# Altium schematic sheet P03_MPU2_Comm.SchDoc
size A
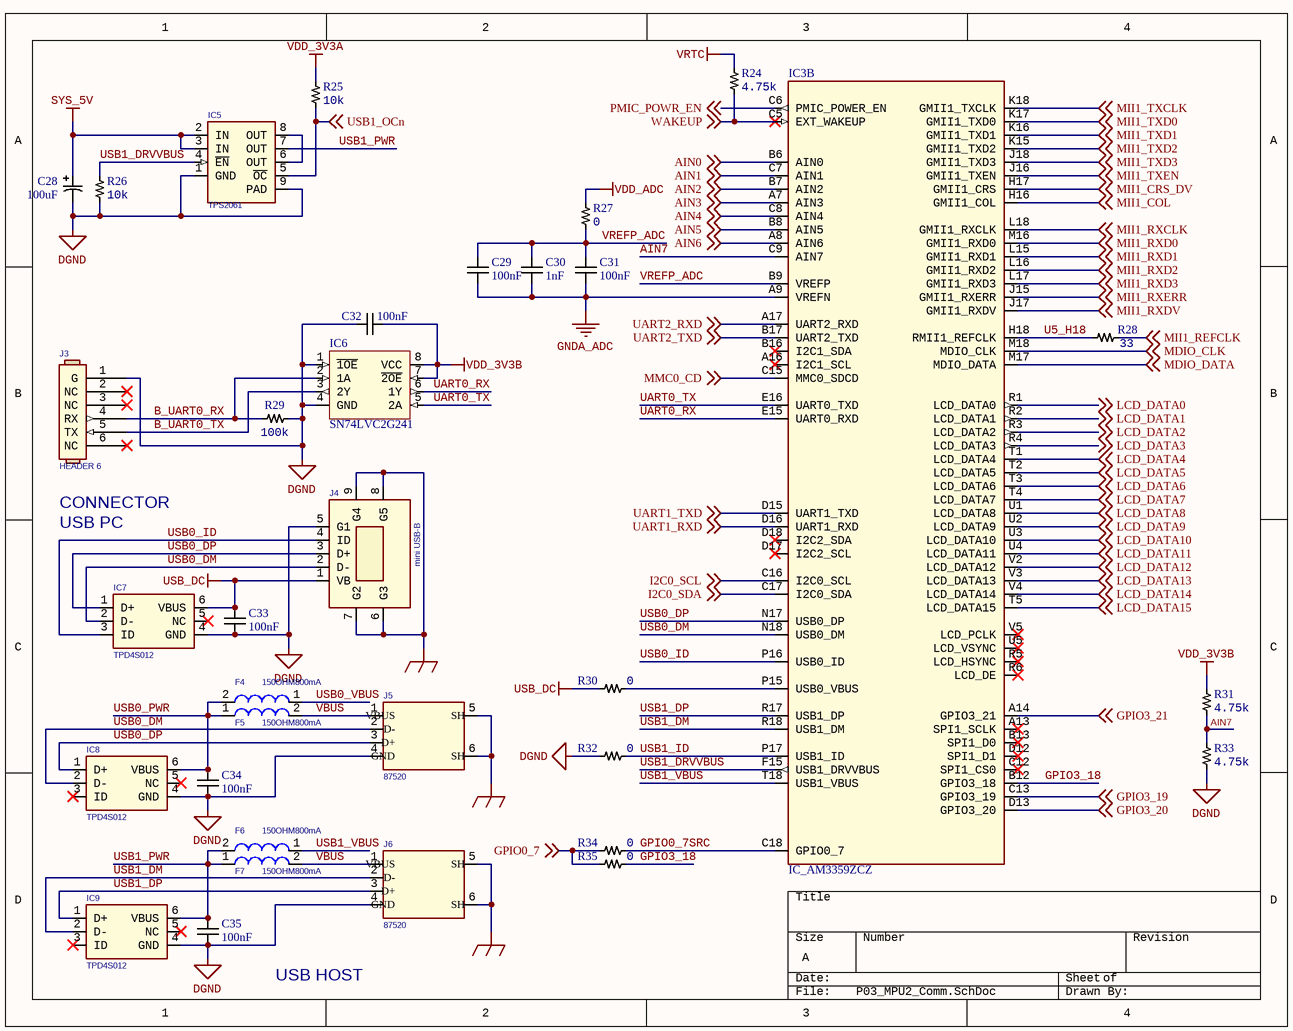
[diagram p0: P03_MPU2_Comm.SchDoc]

## Parts
C28  Capacitance: 100uF  [CAP6.6x6.6]  (hidden comment: EEE-0JA101SP)
C29  Capacitance: 100nF  [CAP0402]  (hidden comment: C0402C104K4RACTU)
C30  Capacitance: 1nF  [CAP0402]  (hidden comment: CC0402KRX7R9BB102)
C31  Capacitance: 100nF  [CAP0402]  (hidden comment: C0402C104K4RACTU)
C32  Capacitance: 100nF  [CAP0402]  (hidden comment: C0402C104K4RACTU)
C33  Capacitance: 100nF  [CAP0402]  (hidden comment: C0402C104K4RACTU)
C34  Capacitance: 100nF  [CAP0402]  (hidden comment: C0402C104K4RACTU)
C35  Capacitance: 100nF  [CAP0402]  (hidden comment: C0402C104K4RACTU)
F4  150OHM800mA  [FB0805]
F5  150OHM800mA  [FB0805]
F6  150OHM800mA  [FB0805]
F7  150OHM800mA  [FB0805]
IC3  IC_AM3359ZCZ  [BGA-324]  (part B of 7)
IC5  TPS2061  [HVSSOP-8]
IC6  SN74LVC2G241  [VSSOP-8]
IC7  TPD4S012  [U_6_DRY]
IC8  TPD4S012  [U_6_DRY]
IC9  TPD4S012  [U_6_DRY]
J3  HEADER 6  [SIP6]
J4  mini USB-B  [USB5MINI_4SHIELDED_SMD-5]
J5  87520  [USB_A]
J6  87520  [USB_A]
R24  Resistance: 4.75k  [RES0402]  (hidden comment: RC0402FR-074K75L)
R25  Resistance: 10k  [RES0402]  (hidden comment: RC0402FR-0710KL)
R26  Resistance: 10k  [RES0402]  (hidden comment: RC0402FR-0710KL)
R27  Resistance: 0  [RES0402]  (hidden comment: RC0402JR-070RL)
R28  Resistance: 33  [RES0402]  (hidden comment: RC0402FR-0733RL)
R29  Resistance: 100k  [RES0402]  (hidden comment: RC0402FR-07100KL)
R30  Resistance: 0  [RES0402]  (hidden comment: RC0402JR-070RL)
R31  Resistance: 4.75k  [RES0402]  (hidden comment: RC0402FR-074K75L)
R32  Resistance: 0  [RES0402]  (hidden comment: RC0402JR-070RL)
R33  Resistance: 4.75k  [RES0402]  (hidden comment: RC0402FR-074K75L)
R34  Resistance: 0  [RES0402]  (hidden comment: RC0402JR-070RL)
R35  Resistance: 0  [RES0402]  (hidden comment: RC0402JR-070RL)

## Nets
DGND: C28.2(C) C32.1 C33.2 C34.2 C35.2 IC5.1(GND) IC5.9(PAD) IC6.1(~{1OE}) IC6.4(GND) IC7.4(GND) IC8.4(GND) IC9.4(GND) J3.1(G) J4.5(G1) J5.4(P4) J6.4(P4) R26.2 R29.1 R32.1 R33.1
GND_EARTH: J4.6(G3) J4.7(G2) J4.8(G5) J4.9(G4) J5.5(SHELD1) J5.6(PAD4) J6.5(SHELD1) J6.6(PAD4)
GNDA_ADC: C29.2 C30.2 C31.2 IC3.A9(VREFN)
SYS_5V: C28.1(A) IC5.2(IN) IC5.3(IN)
USB_DC: C33.1 IC7.6(VBUS) J4.1(VB) R30.1
VDD_3V3A: R25.1
VDD_3V3B: C32.2 IC6.7(~{2OE}) IC6.8(VCC) R31.2
VDD_ADC: R27.2
VRTC: R24.2
AIN0: IC3.B6(AIN0) ; off-sheet AIN0
AIN1: IC3.C7(AIN1) ; off-sheet AIN1
AIN2: IC3.B7(AIN2) ; off-sheet AIN2
AIN3: IC3.A7(AIN3) ; off-sheet AIN3
AIN4: IC3.C8(AIN4) ; off-sheet AIN4
AIN5: IC3.B8(AIN5) ; off-sheet AIN5
AIN6: IC3.A8(AIN6) ; off-sheet AIN6
AIN7: IC3.C9(AIN7) R31.1 R33.2
B_UART0_RX: IC6.2(1A) J3.4(RX) R29.2
B_UART0_TX: IC6.3(2Y) J3.5(TX)
GPIO0_7: R34.2 R35.1 ; off-sheet GPIO0_7
GPIO0_7SRC: IC3.C18(GPIO0_7) R34.1
GPIO3_18: IC3.B12(GPIO3_18) R35.2
GPIO3_19: IC3.C13(GPIO3_19) ; off-sheet GPIO3_19
GPIO3_20: IC3.D13(GPIO3_20) ; off-sheet GPIO3_20
GPIO3_21: IC3.A14(GPIO3_21) ; off-sheet GPIO3_21
I2C0_SCL: IC3.C16(I2C0_SCL) ; off-sheet I2C0_SCL
I2C0_SDA: IC3.C17(I2C0_SDA) ; off-sheet I2C0_SDA
LCD_DATA0: IC3.R1(LCD_DATA0) ; off-sheet LCD_DATA0
LCD_DATA1: IC3.R2(LCD_DATA1) ; off-sheet LCD_DATA1
LCD_DATA2: IC3.R3(LCD_DATA2) ; off-sheet LCD_DATA2
LCD_DATA3: IC3.R4(LCD_DATA3) ; off-sheet LCD_DATA3
LCD_DATA4: IC3.T1(LCD_DATA4) ; off-sheet LCD_DATA4
LCD_DATA5: IC3.T2(LCD_DATA5) ; off-sheet LCD_DATA5
LCD_DATA6: IC3.T3(LCD_DATA6) ; off-sheet LCD_DATA6
LCD_DATA7: IC3.T4(LCD_DATA7) ; off-sheet LCD_DATA7
LCD_DATA8: IC3.U1(LCD_DATA8) ; off-sheet LCD_DATA8
LCD_DATA9: IC3.U2(LCD_DATA9) ; off-sheet LCD_DATA9
LCD_DATA10: IC3.U3(LCD_DATA10) ; off-sheet LCD_DATA10
LCD_DATA11: IC3.U4(LCD_DATA11) ; off-sheet LCD_DATA11
LCD_DATA12: IC3.V2(LCD_DATA12) ; off-sheet LCD_DATA12
LCD_DATA13: IC3.V3(LCD_DATA13) ; off-sheet LCD_DATA13
LCD_DATA14: IC3.V4(LCD_DATA14) ; off-sheet LCD_DATA14
LCD_DATA15: IC3.T5(LCD_DATA15) ; off-sheet LCD_DATA15
MDIO_CLK: IC3.M18(MDIO_CLK) ; off-sheet MDIO_CLK
MDIO_DATA: IC3.M17(MDIO_DATA) ; off-sheet MDIO_DATA
MII1_COL: IC3.H16(GMII1_COL) ; off-sheet MII1_COL
MII1_CRS_DV: IC3.H17(GMII1_CRS) ; off-sheet MII1_CRS_DV
MII1_REFCLK: R28.2 ; off-sheet MII1_REFCLK
MII1_RXCLK: IC3.L18(GMII1_RXCLK) ; off-sheet MII1_RXCLK
MII1_RXD0: IC3.M16(GMII1_RXD0) ; off-sheet MII1_RXD0
MII1_RXD1: IC3.L15(GMII1_RXD1) ; off-sheet MII1_RXD1
MII1_RXD2: IC3.L16(GMII1_RXD2) ; off-sheet MII1_RXD2
MII1_RXD3: IC3.L17(GMII1_RXD3) ; off-sheet MII1_RXD3
MII1_RXDV: IC3.J17(GMII1_RXDV) ; off-sheet MII1_RXDV
MII1_RXERR: IC3.J15(GMII1_RXERR) ; off-sheet MII1_RXERR
MII1_TXCLK: IC3.K18(GMII1_TXCLK) ; off-sheet MII1_TXCLK
MII1_TXD0: IC3.K17(GMII1_TXD0) ; off-sheet MII1_TXD0
MII1_TXD1: IC3.K16(GMII1_TXD1) ; off-sheet MII1_TXD1
MII1_TXD2: IC3.K15(GMII1_TXD2) ; off-sheet MII1_TXD2
MII1_TXD3: IC3.J18(GMII1_TXD3) ; off-sheet MII1_TXD3
MII1_TXEN: IC3.J16(GMII1_TXEN) ; off-sheet MII1_TXEN
MMC0_CD: IC3.C15(MMC0_SDCD) ; off-sheet MMC0_CD
PMIC_POWR_EN: IC3.C6(PMIC_POWER_EN) ; off-sheet PMIC_POWR_EN
U5_H18: IC3.H18(RMII1_REFCLK) R28.1
UART0_RX: IC3.E15(UART0_RXD) IC6.6(1Y)
UART0_TX: IC3.E16(UART0_TXD) IC6.5(2A)
UART1_RXD: IC3.D16(UART1_RXD) ; off-sheet UART1_RXD
UART1_TXD: IC3.D15(UART1_TXD) ; off-sheet UART1_TXD
UART2_RXD: IC3.A17(UART2_RXD) ; off-sheet UART2_RXD
UART2_TXD: IC3.B17(UART2_TXD) ; off-sheet UART2_TXD
USB0_DM: IC3.N18(USB0_DM) IC7.2(D-) IC8.2(D-) J4.2(D-) J5.2(P2)
USB0_DP: IC3.N17(USB0_DP) IC7.1(D+) IC8.1(D+) J4.3(D+) J5.3(P3)
USB0_ID: IC3.P16(USB0_ID) IC7.3(ID) J4.4(ID)
USB0_PWR: C34.1 F4.2 F5.1 IC8.6(VBUS)
USB0_VBUS: F4.1
USB1_DM: IC3.R18(USB1_DM) IC9.2(D-) J6.2(P2)
USB1_DP: IC3.R17(USB1_DP) IC9.1(D+) J6.3(P3)
USB1_DRVVBUS: IC3.F15(USB1_DRVVBUS) IC5.4(~{EN}) R26.1
USB1_ID: IC3.P17(USB1_ID) R32.2
USB1_OCn: IC5.5(~{OC}) R25.2 ; off-sheet USB1_OCn
USB1_PWR: C35.1 F6.2 F7.1 IC5.7(OUT) IC9.6(VBUS)
USB1_VBUS: F6.1 IC3.T18(USB1_VBUS)
VBUS: F5.2 F7.2 J5.1(P1) J6.1(P1)
VREFP_ADC: C29.1 C30.1 C31.1 IC3.B9(VREFP) R27.1
WAKEUP: IC3.C5(EXT_WAKEUP) R24.1 ; off-sheet WAKEUP
NetIC3_P15: IC3.P15(USB0_VBUS) R30.2
NetIC5_6: IC5.6(OUT) IC5.8(OUT)

Not connected (* = marked no-connect by the designer): IC3 A13(SPI1_SCLK)* A16(I2C1_SCL)* B13(SPI1_D0)* B16(I2C1_SDA)* C12(SPI1_CS0)* D12(SPI1_D1)* D17(I2C2_SCL)* D18(I2C2_SDA)* R5(LCD_HSYNC)* R6(LCD_DE)* U5(LCD_VSYNC)* V5(LCD_PCLK)*; IC7 5(NC)*; IC8 3(ID)* 5(NC)*; IC9 3(ID)* 5(NC)*; J3 2(NC)* 3(NC)* 6(NC)*

## Notes on the sheet
- (near J3) CONNECTOR
- USB PC
- USB HOST
- Title
- Size:
- Date:
- A
- Number:
- Time:
- Revision:
- Sheet
- of
- File:
- (in symbol CONN_USBA) VBUS; SH; D-; D+; GND

## Library data of the parts
C28 = CAP_POL_100uF: POL CAP 100uF SMD; Manufacturer: Panasonic; Dielectric Material: Aluminium; Ripple Current: 71mA; Tolerance: 20%; Voltage Rating: 6.3V; Life (Hours): 2000Hour; Leakage Current: 3uA; Lead Length: 2.6mm; Supplier 1: Digi-Key; Manufacturer Part Number: EEE-0JA101SP; Stock 1: 67789; Pricing 1: 1=0.35000, 10=0.24000, 100=0.14420, 500=0.10816 (USD); RoHS: Yes; Mount: Surface Mount,PCB; Case/Package: Radial; Number of Pins: 2; Contact Plating: Tin; Min Operating Temperature: -40°C; Max Operating Temperature: 85°C; Ripple Current (AC): 71mA; Packaging: Tape and Reel; Voltage Rating (DC): 6.3V; Package Quantity: 1; Termination: SMD/SMT; Voltage: 6.3V; Features: General Purpose; Diameter: 6.3mm; Length: 5.5mm; Height: 5.4mm; Height - Seated (Max): 0.213inch; Width: 6.6mm; Lead Pitch: 2.2mm; Radiation Hardening: No; REACH SVHC: No SVHC; Lead Free: Lead Free; ComponentLink1URL: https://datasheet.ciiva.com/11779/0900766b8078636e-11779744.pdf?src-supplier=RSComponents; ComponentLink1Description: https://datasheet.ciiva.com/11779/0900766b8078636e-11779744.pdf?src-supplier=RSComponents; ComponentLink2URL: https://datasheet.ciiva.com/14610/70255710-14610022.pdf?src-supplier=Allied+Electronics; ComponentLink2Description: https://datasheet.ciiva.com/14610/70255710-14610022.pdf?src-supplier=Allied+Electronics; ComponentLink3URL: https://datasheet.ciiva.com/30226/11aba0000ce2-30226184.pdf?src-supplier=Onlinecomponents.com; ComponentLink3Description: https://datasheet.ciiva.com/30226/11aba0000ce2-30226184.pdf?src-supplier=Onlinecomponents.com; ComponentLink4URL: https://datasheet.ciiva.com/16397/aba0000ce2-16397066.pdf?src-supplier=Future+Electronics; ComponentLink4Description: https://datasheet.ciiva.com/16397/aba0000ce2-16397066.pdf?src-supplier=Future+Electronics; ComponentLink5URL: https://datasheet.ciiva.com/46387/aba0000ce2-46387964.pdf?src-supplier=Element14; ComponentLink5Description: https://datasheet.ciiva.com/46387/aba0000ce2-46387964.pdf?src-supplier=Element14; ComponentLink6URL: https://datasheet.ciiva.com/14595/70255710-14595757.pdf?src-supplier=Allied+Electronics; ComponentLink6Description: https://datasheet.ciiva.com/14595/70255710-14595757.pdf?src-supplier=Allied+Electronics; ComponentLink7URL: https://datasheet.ciiva.com/2983/aba0000ce2-2983902.pdf?src-supplier=Avnet; ComponentLink7Description: https://datasheet.ciiva.com/2983/aba0000ce2-2983902.pdf?src-supplier=Avnet; ComponentLink8URL: https://datasheet.ciiva.com/43485/aba0000ce2-43485605.pdf?src-supplier=Farnell; ComponentLink8Description: https://datasheet.ciiva.com/43485/aba0000ce2-43485605.pdf?src-supplier=Farnell; ComponentLink9URL: https://datasheet.ciiva.com/24070/aba0000ce2-40801-24070230.pdf?src-supplier=Mouser; ComponentLink9Description: https://datasheet.ciiva.com/24070/aba0000ce2-40801-24070230.pdf?src-supplier=Mouser; ComponentLink10URL: https://datasheet.ciiva.com/46376/aba0000ce2-46376375.pdf?src-supplier=Element14; ComponentLink10Description: https://datasheet.ciiva.com/46376/aba0000ce2-46376375.pdf?src-supplier=Element14; ComponentLink11URL: https://datasheet.ciiva.com/6134/aba0000ce2-6134361.pdf?src-supplier=Farnell; ComponentLink11Description: https://datasheet.ciiva.com/6134/aba0000ce2-6134361.pdf?src-supplier=Farnell; ComponentLink12URL: https://datasheet.ciiva.com/16539/aba0000ce2-16539929.pdf?src-supplier=Avnet+Asia; ComponentLink12Description: https://datasheet.ciiva.com/16539/aba0000ce2-16539929.pdf?src-supplier=Avnet+Asia; ComponentLink13URL: https://datasheet.ciiva.com/15165/getdatasheetpartid-73778-15165850.pdf?src-supplier=Verical; ComponentLink13Description: https://datasheet.ciiva.com/15165/getdatasheetpartid-73778-15165850.pdf?src-supplier=Verical; ComponentLink14URL: https://datasheet.ciiva.com/17353/aba0000ce2-17353295.pdf?src-supplier=Avnet+Europe; ComponentLink14Description: https://datasheet.ciiva.com/17353/aba0000ce2-17353295.pdf?src-supplier=Avnet+Europe; Supplier Part Number 1: PCE3852CT-ND
C29 C31-C35 = CAP_100nF: MLCC 100nF 0402 SMD; Manufacturer: KEMET; Tolerance: 10%; Voltage Rating (DC): 16V; Dielectric: X7R; Dissipation Factor: 3.5%; Supplier 1: Digi-Key; Supplier Part Number 1: 399-3521-1-ND; Manufacturer Part Number: C0402C104K4RACTU; RoHS: Yes; Stock 1: 6512243; Pricing 1: 1=0.10000, 10=0.04200, 100=0.01860, 500=0.01328, 1000=0.01044, 2500=0.00949, 5000=0.00873 (USD); Packaging: Tape and Reel; Mount: Surface Mount; Case/Package: 0402; Case Code (Imperial): 0402; Case Code (Metric): 1005; Contact Plating: Tin,Matte; Min Operating Temperature: -55°C; Max Operating Temperature: 125°C; Package Quantity: 10000; Voltage Rating: 16V; Termination: SMD/SMT; Length: 1mm; Height: 0.5mm; Width: 0.5mm; Depth: 0.5mm; Radiation Hardening: No; ComponentLink2URL: https://datasheet.ciiva.com/18192/getdatasheetpartid-385384-18192412.pdf?src-supplier=Verical; ComponentLink2Description: Datasheet
C30 = CAP_1nF: MLCC 1nF 0402 SMD; Manufacturer: Yageo; Tolerance: 10%; Dielectric Material: Ceramic; Voltage Rating: 50V; Insulation Resistance: 100GR; Supplier 1: Digi-Key; Manufacturer Part Number: CC0402KRX7R9BB102; RoHS: Yes; Stock 1: 3539064; Pricing 1: 1=0.10000, 10=0.02100, 100=0.00920, 500=0.00654, 1000=0.00514, 2500=0.00468, 5000=0.00430 (USD); Packaging: Tape and Reel; ComponentLink1URL: https://datasheet.ciiva.com/11786/0900766b8079c870-11786157.pdf?src-supplier=RSComponents; ComponentLink1Description: https://datasheet.ciiva.com/11786/0900766b8079c870-11786157.pdf?src-supplier=RSComponents; Mount: Surface Mount; Case/Package: 0402; Case Code (Metric): 1005; Case Code (Imperial): 0402; Min Operating Temperature: -55°C; Max Operating Temperature: 125°C; Length: 0.039inch; Width: 0.02inch; Thickness: 0.022inch; Lead Free: Lead Free; Halogen Free: Halogen Free; ComponentLink2URL: https://datasheet.ciiva.com/143/mlccorderingcode-143956.pdf?src-supplier=Digi-Key; ComponentLink2Description: https://datasheet.ciiva.com/143/mlccorderingcode-143956.pdf?src-supplier=Digi-Key; ComponentLink3URL: https://datasheet.ciiva.com/143/mlccorderingcode-143957.pdf?src-supplier=Digi-Key; ComponentLink3Description: https://datasheet.ciiva.com/143/mlccorderingcode-143957.pdf?src-supplier=Digi-Key; ComponentLink4URL: https://datasheet.ciiva.com/143/mlccorderingcode-143958.pdf?src-supplier=Digi-Key; ComponentLink4Description: https://datasheet.ciiva.com/143/mlccorderingcode-143958.pdf?src-supplier=Digi-Key; ComponentLink5URL: https://datasheet.ciiva.com/13389/upy-gp-np0-16v-to-50v-8-13389974.pdf?src-supplier=Mouser; ComponentLink5Description: https://datasheet.ciiva.com/13389/upy-gp-np0-16v-to-50v-8-13389974.pdf?src-supplier=Mouser; ComponentLink6URL: https://datasheet.ciiva.com/16625/upy-gphc-x7r-6-3v-to-50v-8-16625512.pdf?src-supplier=Avnet+Europe; ComponentLink6Description: https://datasheet.ciiva.com/16625/upy-gphc-x7r-6-3v-to-50v-8-16625512.pdf?src-supplier=Avnet+Europe; ComponentLink7URL: https://datasheet.ciiva.com/15189/getdatasheetpartid-403474-15189131.pdf?src-supplier=Verical; ComponentLink7Description: https://datasheet.ciiva.com/15189/getdatasheetpartid-403474-15189131.pdf?src-supplier=Verical; ComponentLink8URL: https://datasheet.ciiva.com/7978/1489800-7978092.pdf?src-supplier=Element14; ComponentLink8Description: https://datasheet.ciiva.com/7978/1489800-7978092.pdf?src-supplier=Element14; ComponentLink9URL: https://datasheet.ciiva.com/22749/1489800-22749213.pdf?src-supplier=Element14; ComponentLink9Description: https://datasheet.ciiva.com/22749/1489800-22749213.pdf?src-supplier=Element14
F4 F6 = FERR: FERRITE 800MA 150 OHM 0805 SMD; Manufacturer: Laird-Signal Integrity Products; Manufacturer Part Number: LI0805H151R-10; PartName: FerriteBead150ohm800mA; Mfr: Steward; TIIntPartnumber: 1L0010; Vendor: Digikey; Impedance @ Frequency: 150 Ohm @ 100MHz; DC Resistance (DCR): 150 mOhm Max; Filter Type: Differential Mode - Single; Supplier 1: Digi-Key; Supplier Part Number 1: 240-2384-6-ND; RoHS: RoHS Compliant; Category: Filters; Stock 1: 3694; Pricing 1: 1=0.1, 10=0.07, 25=0.064, 50=0.0574, 100=0.0421, 250=0.03064, 500=0.02808, 1000=0.02424 (USD); Package / Case: 0805 (2012 Metric); Size / Dimension: 0.079" L x 0.049" W (2.00mm x 1.25mm); Packaging: Digi-Reel®; ComponentLink1URL: http://www.lairdtech.com/WorkArea/linkit.aspx?LinkIdentifier=id&ItemID=4912; ComponentLink1Description: http://www.lairdtech.com/WorkArea/linkit.aspx?LinkIdentifier=id&ItemID=4912; MfrNum: LI0805H151R-10; Current Rating: 800mA; Mounting Type: Surface Mount; Height (Max): 0.043" (1.10mm)
F5 F7 = FERR: FERRITE 800MA 150 OHM 0805 SMD; PartName: FerriteBead150ohm800mA; Mfr: Steward; MfrNum: LI0805H151R-10; TIIntPartnumber: 1L0010; Manufacturer: Laird-Signal Integrity Products; Vendor: Digikey; Impedance @ Frequency: 150 Ohm @ 100MHz; DC Resistance (DCR): 150 mOhm Max; Filter Type: Differential Mode - Single; Supplier 1: Digi-Key; Supplier Part Number 1: 240-2384-6-ND; Manufacturer Part Number: LI0805H151R-10; RoHS: RoHS Compliant; Category: Filters; Stock 1: 3694; Pricing 1: 1=0.1, 10=0.07, 25=0.064, 50=0.0574, 100=0.0421, 250=0.03064, 500=0.02808, 1000=0.02424 (USD); Current Rating: 800mA; Package / Case: 0805 (2012 Metric); Mounting Type: Surface Mount; Packaging: Digi-Reel®; Height (Max): 0.043" (1.10mm); Size / Dimension: 0.079" L x 0.049" W (2.00mm x 1.25mm); ComponentLink1URL: http://www.lairdtech.com/WorkArea/linkit.aspx?LinkIdentifier=id&ItemID=4912; ComponentLink1Description: http://www.lairdtech.com/WorkArea/linkit.aspx?LinkIdentifier=id&ItemID=4912
IC3 = IC_AM335X_ZCE_1: SubArctic Cortex A8 Processor 18x18; Manufacturer: Texas Instruments; Manufacturer Part Number: XAM3359ZCZ; Processor Type: ARM Microprocessor; Voltage: 1.06 V ~ 1.15 V; Supplier 1: Digi-Key; Supplier Part Number 1: 296-35073-ND; RoHS: RoHS Compliant; Category: Integrated Circuits (ICs); Stock 1: 16; Pricing 1: 1=33.5, 10=30.988, 100=26.465, 250=24.28752, 500=23.115, 1000=21.775, 2500=21.105, 5000=20.6025, 10000=20.1 (USD); Features: -; Speed: -; Mounting Type: Surface Mount; Package / Case: 324-LFBGA; Supplier Device Package: 324-NFBGA(15x15); Packaging: Tray; ComponentLink1URL: http://www.ti.com/lit/ds/symlink/am3354.pdf; ComponentLink1Description: http://www.ti.com/lit/ds/symlink/am3354.pdf
IC5 = TPS2061: IC 1.5A PWR DIST SWITCH 8-SOIC; Manufacturer: Texas Instruments; Manufacturer Part Number: TPS2051BDGNR; Number of Outputs: 1; Rds (On): 135 mOhm; Internal Switch(s): Yes; Current Limit: 1A; Voltage - Input: 2.7 V ~ 5.5 V; Supplier 1: Digi-Key; Supplier Part Number 1: 296-17313-6-ND; RoHS: RoHS Compliant; Category: Integrated Circuits (ICs); Stock 1: 7065; Pricing 1: 1=1.82, 10=1.642, 25=1.4708, 100=1.3224, 250=1.1742, 500=1.026, 1000=0.8493 (USD); Type: High Side Switch; Operating Temperature: -40°C ~ 85°C; Mounting Type: Surface Mount; Package / Case: 8-TSSOP, 8-MSOP (0.118", 3.00mm Width) Exposed Pad; Supplier Device Package: 8-MSOP-PowerPad; Packaging: Digi-Reel®; ComponentLink1URL: http://www.ti.com/lit/ds/symlink/tps2061.pdf; ComponentLink1Description: Datasheet
IC6 = SN74LVC2G241: IC BUFF/DVR TRI-ST DL 8VSSOP; Manufacturer: Texas Instruments; Manufacturer Part Number: SN74LVC2G241DCUR; Logic Type: Buffer/Line Driver, Non-Inverting; Number of Elements: 2; Number of Bits per Element: 1; Current - Output High, Low: 32mA, 32mA; Voltage - Supply: 1.65 V ~ 5.5 V; Supplier 1: Digi-Key; Supplier Part Number 1: 296-11936-6-ND; RoHS: RoHS Compliant; Category: Integrated Circuits (ICs); Stock 1: 28602; Pricing 1: 1=0.49, 10=0.428, 25=0.3756 (USD); Operating Temperature: -40°C ~ 85°C; Mounting Type: Surface Mount; Package / Case: 8-VFSOP (0.091", 2.30mm Width); Supplier Device Package: US8; Packaging: Digi-Reel®; ComponentLink1URL: http://www.ti.com/lit/ds/symlink/sn74lvc2g241.pdf; ComponentLink1Description: http://www.ti.com/lit/ds/symlink/sn74lvc2g241.pdf
IC7-IC9 = PROT_TPD4S012: ESD 4channel USB Interface; Mfr: TI; MfrNum: TPD4S012DRY; TIIntPartnumber: 1A0233; Manufacturer: Texas Instruments; Manufacturer Part Number: TPD4S012DRYR; Vendor: Digikey; Cost100: 0.76; Cost10K: 0.23; Power (Watts): 60W; Number of Circuits: 4; PartName: TPD4S012; Supplier 1: Digi-Key; Supplier Part Number 1: 296-24244-6-ND; RoHS: RoHS Compliant; Category: Circuit Protection; Stock 1: 7978; Pricing 1: 1=0.78, 10=0.682, 25=0.6028, 100=0.2552, 250=0.25044, 500=0.2457, 750=0.24097 (USD); Voltage - Working: -; Voltage - Clamping: -; Technology: Mixed Technology; Applications: USB; Package / Case: 6-UFDFN; Supplier Device Package: 6-SON (1.45x1); Packaging: Digi-Reel®; ComponentLink1URL: http://www.ti.com/lit/ds/symlink/tpd4s012.pdf; ComponentLink1Description: http://www.ti.com/lit/ds/symlink/tpd4s012.pdf
J3 = HDR_6x1: CONN HEADER 6POS, VERTICAL,  .100 STR TIN; Manufacturer: Samtec Inc; Manufacturer Part Number: FTR-110-03-G-D-06; Connector Type: Unshrouded; Number of Positions: 20; Number of Positions Loaded: 19; Pitch: 0.050" (1.27mm); Row Spacing: 0.100" (2.54mm); Supplier 1: Digi-Key; Supplier Part Number 1: FTR-110-03-G-D-06-ND; RoHS: RoHS Compliant; Category: Connectors, Interconnects; Stock 1: 0; Pricing 1: 1=4.47 (USD); Number of Rows: 2; Contact Mating Length: 0.125" (3.18mm); Mounting Type: Surface Mount; Termination: Solder; Features: -; Contact Finish: Gold; Contact Finish Thickness: 10µin (0.25µm); Color: Black; Packaging: Tube; ComponentLink1URL: http://www.samtec.com/documents/webfiles/cpdf/FTR-1XX-XX-XX-D-X-XX-MKT.pdf; ComponentLink1Description: http://www.samtec.com/documents/webfiles/cpdf/FTR-1XX-XX-XX-D-X-XX-MKT.pdf; Height Stacking (Mating): -; Molding Height Above Board: 0.100" (2.54mm)
J4 = MINI-USB-AB-SOCKET: CONN RCPT USB MINI B R/A SMD; Manufacturer: KYCON; Manufacturer Part Number: 0565790576; Order# 2: C-440247; ATLStockNo1: 4500.0223; Order#: KMAB-SMT-5S-S-30TR; Connector Type: USB - mini AB; Number of Contacts: 5; Gender: Receptacle; Specifications: USB 2.0 OTG; Manufacturer 2: AMP; Distributor: Deltron; Distributor 2: Tyco; Supplier 1: Digi-Key; Supplier Part Number 1: WM17122DKR-ND; RoHS: RoHS Compliant; Category: Connectors, Interconnects; Stock 1: 12426; Pricing 1: 1=2.92, 10=2.649, 25=2.4872, 50=2.3792, 100=2.271, 250=2.05468 (USD); Mounting Type: Surface Mount, Right Angle, Horizontal; Features: Shielded; Packaging: Digi-Reel®; Ingress Protection: -; ComponentLink1URL: http://www.molex.com/pdm_docs/sd/565790576_sd.pdf; ComponentLink1Description: http://www.molex.com/pdm_docs/sd/565790576_sd.pdf
J5 J6 = CONN_USBA: CONN RCPT USB TYPE A R/A PCB; Manufacturer: FCI; Manufacturer Part Number: 87520-0010BLF; CLASS: IO; TN: 224-0234-000; Connector Type: USB - A; Number of Contacts: 4; Gender: Receptacle; Specifications: USB 2.0; Supplier 1: Digi-Key; Supplier Part Number 1: 609-1045-ND; RoHS: RoHS Compliant; Category: Connectors, Interconnects; Stock 1: 4363; Pricing 1: 1=0.78, 10=0.734, 25=0.6604, 50=0.587, 100=0.5626, 250=0.51368, 500=0.4892, 1000=0.40359, 2500=0.3669 (USD); Mounting Type: Through Hole, Right Angle, Horizontal; Features: Board Lock; Packaging: Tube; Ingress Protection: -; ComponentLink1URL: http://portal.fciconnect.com/Comergent//fci/drawing/87520.pdf; ComponentLink1Description: http://portal.fciconnect.com/Comergent//fci/drawing/87520.pdf
R24 R31 R33 = RES_4.75k: Resistor 4.75kOhm 0402 SMD; Manufacturer: Yageo; Temperature Coefficient: 100ppm/°C; Tolerance: 1%; Voltage Rating: 50V; Power Rating: 62.5mW; Max Power Dissipation: 63mW; Supplier 1: Digi-Key; Manufacturer Part Number: RC0402FR-074K75L; RoHS: Yes; Stock 1: 9368381; Pricing 1: 1=0.10000, 10=0.01600, 100=0.00640, 1000=0.00289, 2500=0.00251, 5000=0.00207 (USD); Composition: Thick Film; Features: Moisture Resistant; Height: 0.016inch; Number of Terminations: 2; Packaging: Tape and Reel; ComponentLink1URL: https://datasheet.ciiva.com/11808/0900766b80c66297-11808814.pdf?src-supplier=RSComponents; ComponentLink1Description: https://datasheet.ciiva.com/11808/0900766b80c66297-11808814.pdf?src-supplier=RSComponents; Case/Package: 0402; Case Code (Imperial): 0402; Case Code (Metric): 1005; Min Operating Temperature: -55°C; Max Operating Temperature: 155°C; Package Quantity: 1; Termination: SMD/SMT; Military Standard: Not; Voltage Rating (DC): 50V; Working Voltage: 50V; Length: 1mm; Width: 0.5mm; Depth: 0.5mm; REACH SVHC: No SVHC; Lead Free: Lead Free; ComponentLink2URL: https://datasheet.ciiva.com/15189/getdatasheetpartid-326465-15189478.pdf?src-supplier=Verical; ComponentLink2Description: https://datasheet.ciiva.com/15189/getdatasheetpartid-326465-15189478.pdf?src-supplier=Verical; ComponentLink3URL: https://datasheet.ciiva.com/2553/pyu-r-int-thick-7-2553224.pdf?src-supplier=Digi-Key; ComponentLink3Description: https://datasheet.ciiva.com/2553/pyu-r-int-thick-7-2553224.pdf?src-supplier=Digi-Key; ComponentLink4URL: https://datasheet.ciiva.com/7983/1018594-7983544.pdf?src-supplier=Element14; ComponentLink4Description: https://datasheet.ciiva.com/7983/1018594-7983544.pdf?src-supplier=Element14; ComponentLink5URL: https://datasheet.ciiva.com/2553/pyu-r-int-thick-7-2553225.pdf?src-supplier=Digi-Key; ComponentLink5Description: https://datasheet.ciiva.com/2553/pyu-r-int-thick-7-2553225.pdf?src-supplier=Digi-Key; ComponentLink6URL: https://datasheet.ciiva.com/2553/pyu-r-int-thick-7-2553226.pdf?src-supplier=Digi-Key; ComponentLink6Description: https://datasheet.ciiva.com/2553/pyu-r-int-thick-7-2553226.pdf?src-supplier=Digi-Key; ComponentLink7URL: https://datasheet.ciiva.com/16744/pyu-rc0402-51-rohs-l-6-r-16744524.pdf?src-supplier=Future+Electronics; ComponentLink7Description: https://datasheet.ciiva.com/16744/pyu-rc0402-51-rohs-l-6-r-16744524.pdf?src-supplier=Future+Electronics
R25 R26 = RES_10k: Resistor 10kOhm 0402 SMD; Manufacturer: Yageo; Temperature Coefficient: 100ppm/°C; Tolerance: 1%; Voltage Rating (DC): 50V; Power Rating: 62.5mW; Supplier 1: Digi-Key; Manufacturer Part Number: RC0402FR-0710KL; RoHS: Yes; Stock 1: 72891652; Pricing 1: 1=0.10000, 10=0.01500, 100=0.00600, 1000=0.00270, 2500=0.00235, 5000=0.00194 (USD); Composition: Thick Film; Height: 0.32mm; Number of Terminations: 2; Packaging: Tape and Reel; ComponentLink1URL: https://datasheet.ciiva.com/7660/38568-7660787.pdf?src-supplier=Element14; ComponentLink1Description: https://datasheet.ciiva.com/7660/38568-7660787.pdf?src-supplier=Element14; Case/Package: 0402; Number of Pins: 2; Case Code (Imperial): 0402; Case Code (Metric): 1005; Min Operating Temperature: -55°C; Max Operating Temperature: 155°C; Voltage Rating: 50V; Termination: SMD/SMT; Military Standard: Not; Working Voltage: 50V; Length: 1mm; Width: 0.5mm; Depth: 0.5mm; Lead Pitch: 0.2mm; REACH SVHC: No SVHC; Lead Free: Lead Free; ComponentLink2URL: https://datasheet.ciiva.com/7983/1018594-7983486.pdf?src-supplier=Element14; ComponentLink2Description: https://datasheet.ciiva.com/7983/1018594-7983486.pdf?src-supplier=Element14; ComponentLink3URL: https://datasheet.ciiva.com/7849/1784430-7849813.pdf?src-supplier=Element14; ComponentLink3Description: https://datasheet.ciiva.com/7849/1784430-7849813.pdf?src-supplier=Element14; ComponentLink4URL: https://datasheet.ciiva.com/7849/1686128-7849814.pdf?src-supplier=Element14; ComponentLink4Description: https://datasheet.ciiva.com/7849/1686128-7849814.pdf?src-supplier=Element14; ComponentLink5URL: https://datasheet.ciiva.com/7849/1784430-7849815.pdf?src-supplier=Element14; ComponentLink5Description: https://datasheet.ciiva.com/7849/1784430-7849815.pdf?src-supplier=Element14; ComponentLink6URL: https://datasheet.ciiva.com/22747/1018594-22747512.pdf?src-supplier=Element14; ComponentLink6Description: https://datasheet.ciiva.com/22747/1018594-22747512.pdf?src-supplier=Element14; ComponentLink7URL: https://datasheet.ciiva.com/12667/pyu-rc0402-51-rohs-l-6-r-12667067.pdf?src-supplier=Mouser; ComponentLink7Description: https://datasheet.ciiva.com/12667/pyu-rc0402-51-rohs-l-6-r-12667067.pdf?src-supplier=Mouser
R27 R30 R32 R35 = RES_0: Resistor 0Ohm 0402 SMD; Manufacturer: Yageo; Power Rating: 62.5mW; Tolerance: 5%; Voltage Rating: 50V; Temperature Coefficient: 200ppm/°C; Max Power Dissipation: 63mW; Supplier 1: Digi-Key; Manufacturer Part Number: RC0402JR-070RL; Stock 1: 68160806; Pricing 1: 1=0.10000, 10=0.01300, 25=0.00920, 50=0.00700, 100=0.00510, 250=0.00392, 500=0.00312, 1000=0.00230, 5000=0.00165 (USD); RoHS: Yes; Case/Package: 0402; Contact Plating: Tin,Matte; Case Code (Metric): 1005; Case Code (Imperial): 0402; Min Operating Temperature: -55°C; Max Operating Temperature: 155°C; Composition: Thick Film; Packaging: Tape and Reel; Termination: SMD/SMT; Package Quantity: 1; Number of Terminations: 2; Military Standard: Not; Features: Moisture Resistant; Length: 1mm; Height: 0.016inch; Width: 0.02inch; Depth: 0.5mm; Radiation Hardening: No; Lead Free: Lead Free; REACH SVHC: Unknown; Supplier Part Number 1: 311-0.0JRCT-ND; ComponentLink1Description: Digikey; ComponentLink1URL: https://www.digikey.com/product-detail/en/yageo/RC0402JR-070RL/311-0.0JRCT-ND/729353; ComponentLink2Description: Datasheet; ComponentLink2URL: https://www.yageo.com/upload/media/product/productsearch/datasheet/rchip/PYu-RC_Group_51_RoHS_L_10.pdf
R28 = RES_33: Resistor 33Ohm 0402 SMD; Manufacturer: Yageo; Power Rating: 62.5mW; Tolerance: 1%; Voltage Rating: 50V; Temperature Coefficient: 100ppm/°C; Supplier 1: Digi-Key; Manufacturer Part Number: RC0402FR-0733RL; Stock 1: 5631148; Pricing 1: 1=0.10000, 10=0.01600, 100=0.00640, 1000=0.00289, 2500=0.00251, 5000=0.00207 (USD); RoHS: Yes; Case/Package: 0402; Number of Pins: 2; Case Code (Imperial): 0402; Case Code (Metric): 1005; Min Operating Temperature: -55°C; Max Operating Temperature: 155°C; Composition: Thick Film; Packaging: Tape and Reel; Voltage Rating (DC): 50V; Package Quantity: 10000; Termination: SMD/SMT; Military Standard: Not; Length: 1mm; Height: 0.35mm; Width: 0.5mm; Depth: 0.5mm; REACH SVHC: Unknown; Lead Free: Lead Free; ComponentLink1URL: https://datasheet.ciiva.com/11819/0900766b80c66297-11819487.pdf?src-supplier=RSComponents; ComponentLink1Description: https://datasheet.ciiva.com/11819/0900766b80c66297-11819487.pdf?src-supplier=RSComponents; ComponentLink2URL: https://datasheet.ciiva.com/15189/getdatasheetpartid-329253-15189431.pdf?src-supplier=Verical; ComponentLink2Description: https://datasheet.ciiva.com/15189/getdatasheetpartid-329253-15189431.pdf?src-supplier=Verical; ComponentLink3URL: https://datasheet.ciiva.com/24070/pyu-rc0402-51-rohs-l-6-r-8721-24070077.pdf?src-supplier=Mouser; ComponentLink3Description: https://datasheet.ciiva.com/24070/pyu-rc0402-51-rohs-l-6-r-8721-24070077.pdf?src-supplier=Mouser; ComponentLink4URL: https://datasheet.ciiva.com/7849/1018594-7849966.pdf?src-supplier=Element14; ComponentLink4Description: https://datasheet.ciiva.com/7849/1018594-7849966.pdf?src-supplier=Element14; ComponentLink5URL: https://datasheet.ciiva.com/7849/1018594-7849967.pdf?src-supplier=Element14; ComponentLink5Description: https://datasheet.ciiva.com/7849/1018594-7849967.pdf?src-supplier=Element14; ComponentLink6URL: https://datasheet.ciiva.com/17070/pyu-rc0402-51-rohs-l-6-r-17070335.pdf?src-supplier=Future+Electronics; ComponentLink6Description: https://datasheet.ciiva.com/17070/pyu-rc0402-51-rohs-l-6-r-17070335.pdf?src-supplier=Future+Electronics
R29 = RES_100k: Resistor 100kOhm 0402 SMD; Manufacturer: Yageo; Tolerance: 1%; Temperature Coefficient: 100ppm/°C; Power Rating: 63mW; Voltage Rating: 50V; Manufacturer Part Number: RC0402FR-07100KL; RoHS: Yes; Case/Package: 0402; Case Code (Metric): 1005; Case Code (Imperial): 0402; Min Operating Temperature: -55°C; Max Operating Temperature: 155°C; Composition: Thick Film; Packaging: Tape and Reel; Package Quantity: 1; Number of Terminations: 2; Termination: SMD/SMT; Military Standard: Not; Max Power Dissipation: 63mW; Working Voltage: 50V; Features: Moisture Resistant; Length: 0.039inch; Height: 0.016inch; Width: 0.02inch; Depth: 0.5mm; REACH SVHC: No SVHC; Lead Free: Lead Free; ComponentLink2Description: Datasheet; ComponentLink2URL: https://www.yageo.com/upload/media/product/productsearch/datasheet/rchip/PYu-RC_Group_51_RoHS_L_10.pdf; Supplier 1: Mouser; Supplier 2: Digi-Key; Supplier Part Number 1: 603-RC0402FR-07100KL; Supplier Part Number 2: 311-100KLRCT-ND
R34 = RES_0: Resistor 0Ohm 0402 SMD; Manufacturer: Yageo; Temperature Coefficient: 200ppm/°C; Tolerance: 5%; Power Rating: 62.5mW; Voltage Rating: 50V; Max Power Dissipation: 63mW; ComponentLink1Description: Digikey; ComponentLink1URL: https://www.digikey.com/product-detail/en/yageo/RC0402JR-070RL/311-0.0JRCT-ND/729353; Composition: Thick Film; Features: Moisture Resistant; Height: 0.016inch; Manufacturer Part Number: RC0402JR-070RL; Number of Terminations: 2; Packaging: Tape and Reel; Pricing 1: 1=0.10000, 10=0.01300, 25=0.00920, 50=0.00700, 100=0.00510, 250=0.00392, 500=0.00312, 1000=0.00230, 5000=0.00165 (USD); RoHS: Yes; Stock 1: 68160806; Supplier 1: Digi-Key; Supplier Part Number 1: 311-0.0JRCT-ND; Case/Package: 0402; Contact Plating: Tin,Matte; Case Code (Metric): 1005; Case Code (Imperial): 0402; Min Operating Temperature: -55°C; Max Operating Temperature: 155°C; Termination: SMD/SMT; Package Quantity: 1; Military Standard: Not; Length: 1mm; Width: 0.02inch; Depth: 0.5mm; Radiation Hardening: No; Lead Free: Lead Free; REACH SVHC: Unknown; ComponentLink2Description: Datasheet; ComponentLink2URL: https://www.yageo.com/upload/media/product/productsearch/datasheet/rchip/PYu-RC_Group_51_RoHS_L_10.pdf